# Altium project BFMC_ProcessingAllBoard.PrjPcb (part 2 of 2)
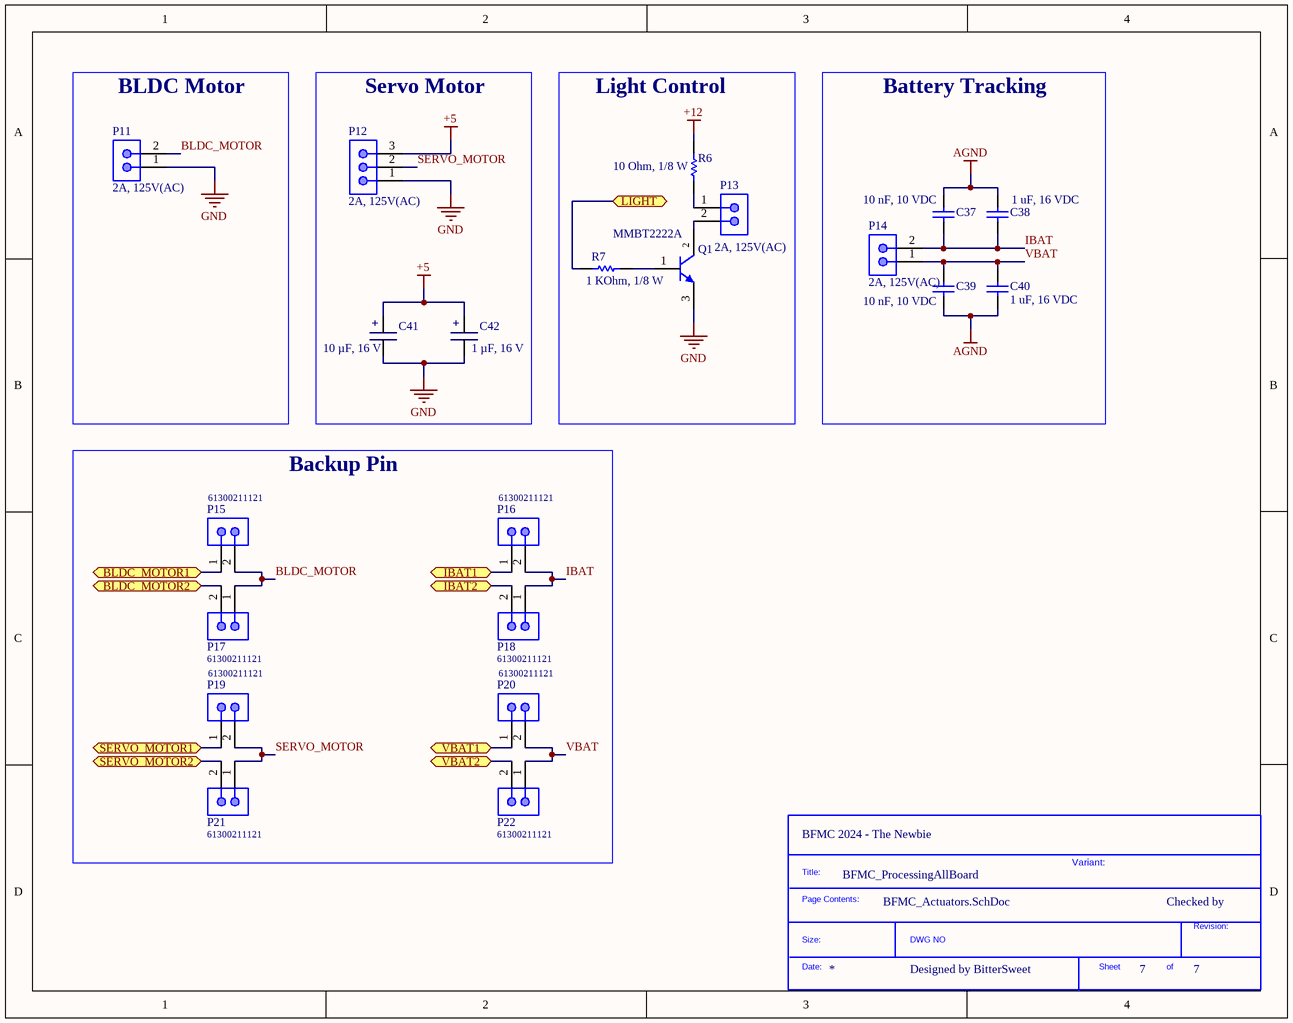
[diagram p7: BFMC_Actuators.SchDoc]

## Nets that join several sheets
+3.3: BFMC_PowerDistribution (5 pins), BFMC_Microcontrollers (6 pins), BFMC_SensorProcessing (C27.2 C28.2 P7.1)
+5: BFMC_PowerDistribution (8 pins), BFMC_Microcontrollers (12 pins), BFMC_SensorProcessing (21 pins), BFMC_Actuators (C41.2 C42.2 P12.3)
+12: BFMC_PowerDistribution (6 pins), BFMC_Actuators (R6.2)
AGND: BFMC_PowerDistribution (T2.1 T4.1), BFMC_Actuators (C37.2 C38.2 C39.1 C40.1)
AGND1: BFMC_PowerDistribution (T3.1), BFMC_SensorProcessing (5 pins)
DGND: BFMC_PowerDistribution (T1.1), BFMC_Microcontrollers (20 pins)
GND: BFMC_PowerDistribution (19 pins), BFMC_Microcontrollers (D6.1 D7.1), BFMC_SensorProcessing (22 pins), BFMC_Actuators (5 pins)
NetC35_2: BFMC_Microcontrollers (U3.18), BFMC_SensorProcessing (C35.2 C36.2 P7.4)
NetP3_1: BFMC_Microcontrollers (U3.1), BFMC_SensorProcessing (P3.1)
NetP3_2: BFMC_Microcontrollers (U3.2), BFMC_SensorProcessing (P3.2)
NetP3_4: BFMC_Microcontrollers (U3.3), BFMC_SensorProcessing (P3.4)
NetP3_5: BFMC_Microcontrollers (U3.4), BFMC_SensorProcessing (P3.5)
NetP4_2: BFMC_Microcontrollers (U3.6), BFMC_SensorProcessing (P4.2)
NetP4_3: BFMC_Microcontrollers (U3.5), BFMC_SensorProcessing (P4.3)
NetP5_2: BFMC_Microcontrollers (U3.7), BFMC_SensorProcessing (P5.2)
NetP5_3: BFMC_Microcontrollers (U3.8), BFMC_SensorProcessing (P5.3)
NetP6_2: BFMC_Microcontrollers (U3.10), BFMC_SensorProcessing (P6.2)
NetP6_3: BFMC_Microcontrollers (U3.9), BFMC_SensorProcessing (P6.3)
NetP7_3: BFMC_Microcontrollers (U3.17), BFMC_SensorProcessing (P7.3)
NetP8_2: BFMC_Microcontrollers (U3.11), BFMC_SensorProcessing (P8.2)
NetP8_3: BFMC_Microcontrollers (U3.12), BFMC_SensorProcessing (P8.3)
NetP9_2: BFMC_Microcontrollers (U3.13), BFMC_SensorProcessing (P9.2)
NetP9_3: BFMC_Microcontrollers (U3.14), BFMC_SensorProcessing (P9.3)
NetP10_2: BFMC_Microcontrollers (U3.15), BFMC_SensorProcessing (P10.2)
NetP10_3: BFMC_Microcontrollers (U3.16), BFMC_SensorProcessing (P10.3)
NetP15_1: BFMC_Microcontrollers (U2.CN10_33), BFMC_Actuators (P15.1)
NetP16_1: BFMC_Microcontrollers (U2.CN10_35), BFMC_Actuators (P16.1)
NetP17_2: BFMC_Microcontrollers (U2.CN10_31), BFMC_Actuators (P17.2)
NetP18_2: BFMC_Microcontrollers (U2.CN10_37), BFMC_Actuators (P18.2)
NetP19_1: BFMC_Microcontrollers (U2.CN10_29), BFMC_Actuators (P19.1)
NetP20_1: BFMC_Microcontrollers (U2.CN7_30), BFMC_Actuators (P20.1)
NetP21_2: BFMC_Microcontrollers (U2.CN10_27), BFMC_Actuators (P21.2)
NetP22_2: BFMC_Microcontrollers (U2.CN7_32), BFMC_Actuators (P22.2)
NetR7_1: BFMC_Microcontrollers (U3.20), BFMC_Actuators (R7.1)